# Altium schematic sheet BatteryManagementSystem.SchDoc
size A4; SheetNumber: 8; SheetTotal: 13
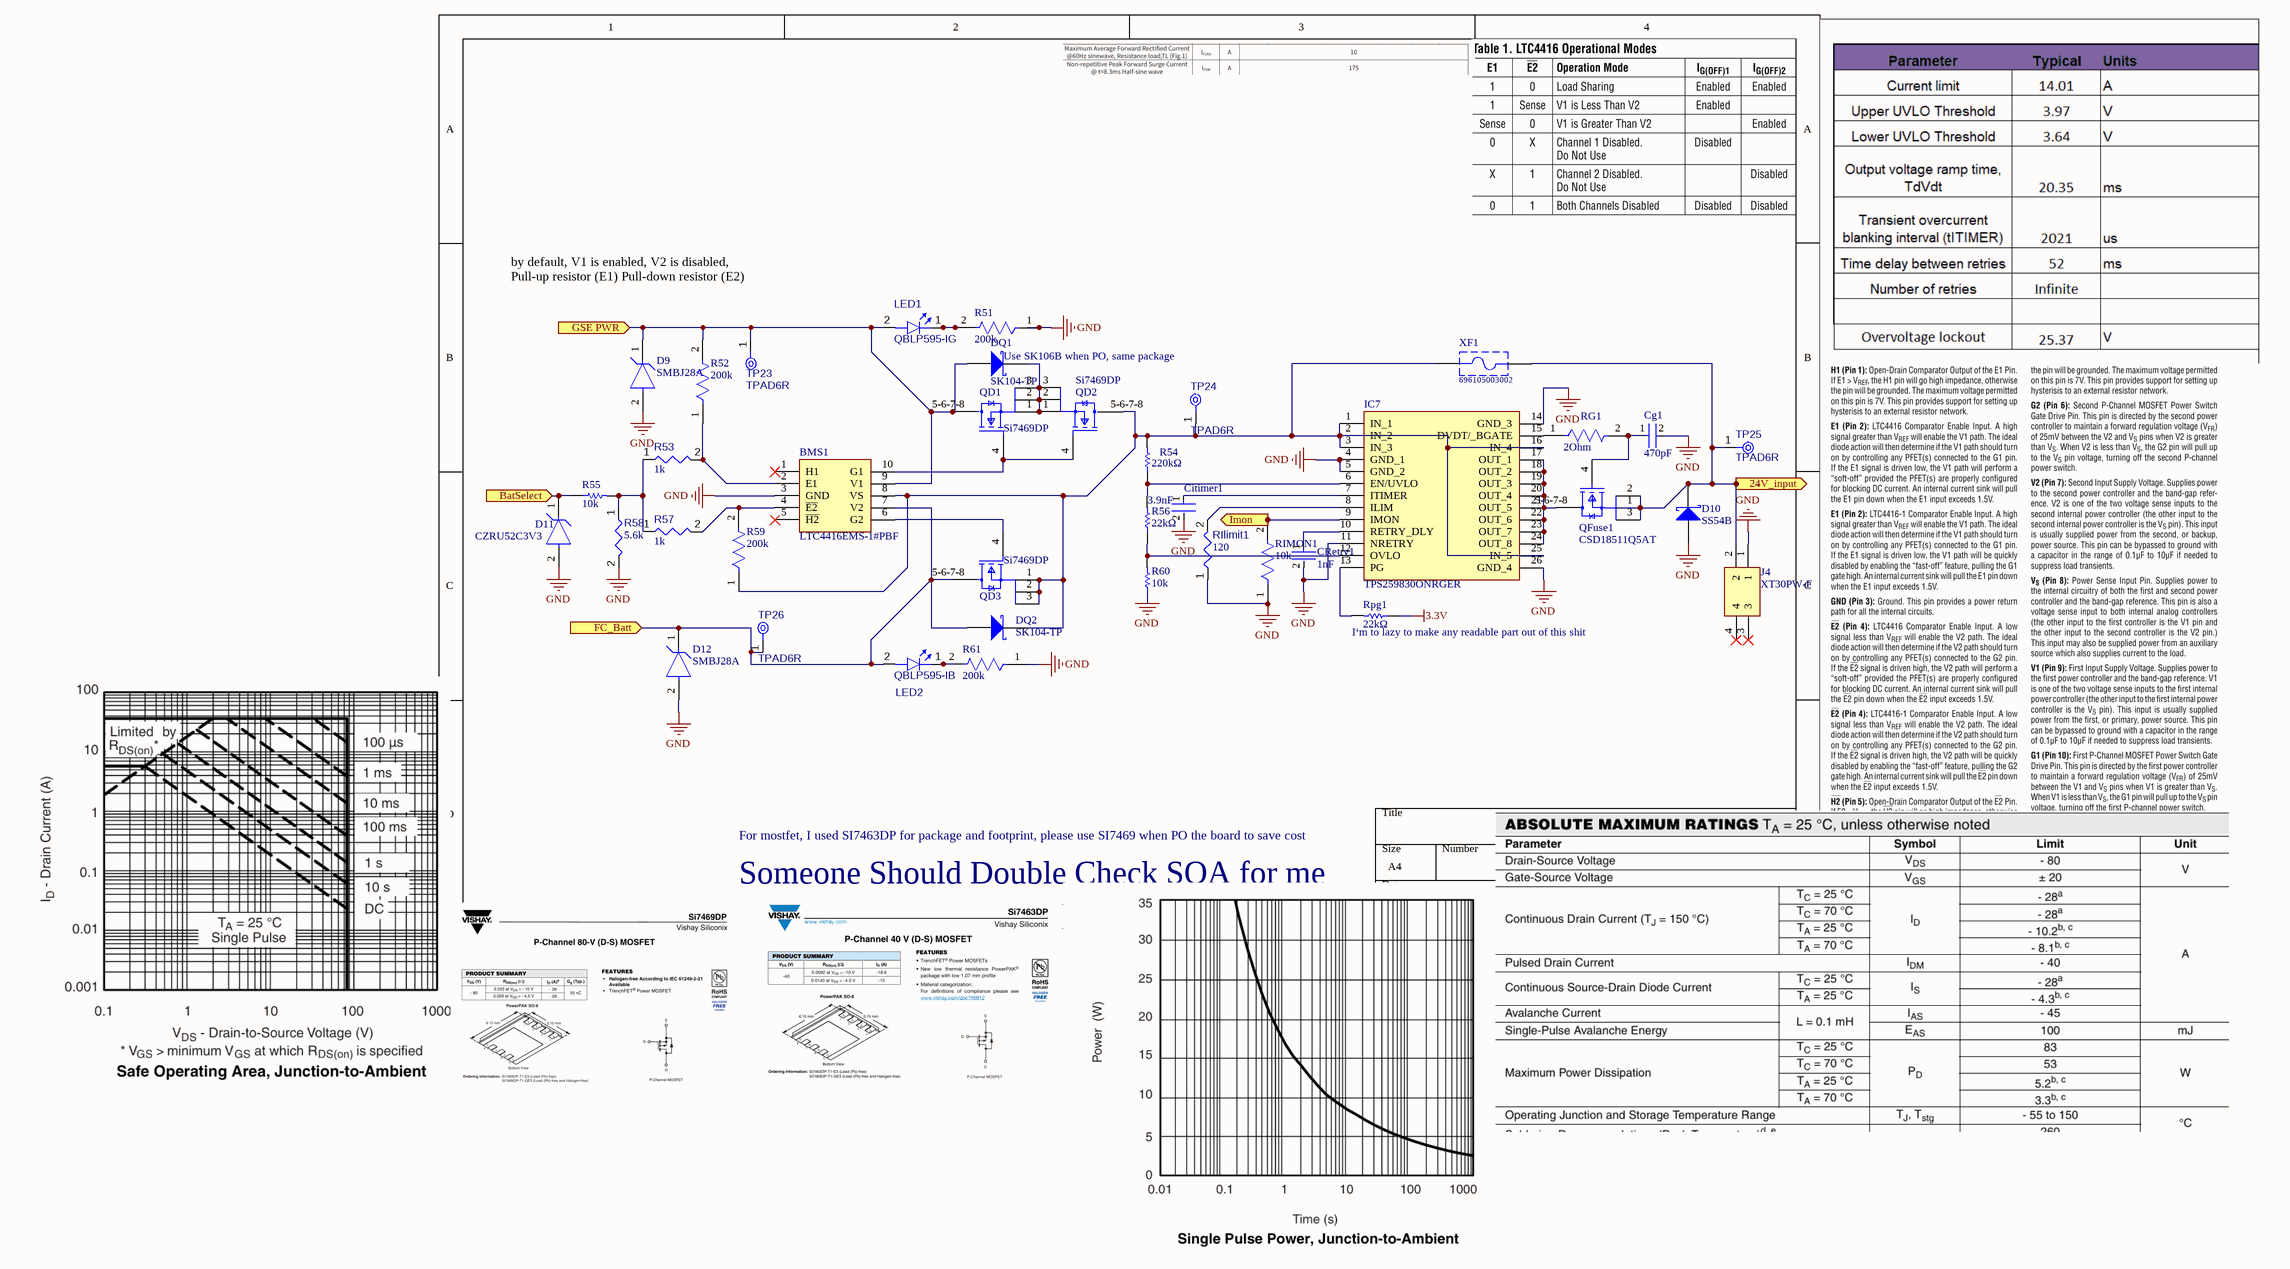
[diagram p0: BatteryManagementSystem.SchDoc]

## Parts
BMS1  LTC4416EMS-1#PBF  [SOP50P490X110-10N]
Cg1  470pF  [FP-CC0603-DA-MFG]
Citimer1  3.9nF  [FP-CC0603-DA-MFG]
CRetry1  1nF  [FP-0603-L_1_6_0_15-W_0_81-IPC_A]
D9  SMBJ28A  [FP-SMBJ-MFG]
D10  SS54B  [JCET-SMB-2_M]
D11  CZRU52C3V3  [FP-0603-SOD-523F-MFG]
D12  SMBJ28A  [FP-SMBJ-MFG]
DQ1  SK104-TP  [MCC-DO-214AB-2_V]
DQ2  SK104-TP  [MCC-DO-214AB-2_V]
IC7  TPS259830ONRGER  [TPS259830ONRGER]
J4  XT30PW-F  [XT30PWF]
LED1  QBLP595-IG  [QTB-QBLP595_V]
LED2  QBLP595-IB  [QTB-QBLP595_V]
QD1  Si7469DP  [FP-S17-0173-SINGLE-MFG]
QD2  Si7469DP  [FP-S17-0173-SINGLE-MFG]
QD3  Si7469DP  [FP-S17-0173-SINGLE-MFG]
QFuse1  CSD18511Q5AT  [FP-DQJ0008A-MFG]
R51  200k  [FP-RC0603-0_55-IPC_B]
R52  200k  [FP-RC0603-0_55-IPC_B]
R53  value 1k  [RESC1608X55X25ML10T15]  (hidden comment: Resistor 1k +/-1% 0603 100 mW)
R54  220kΩ  [RESC1608X55X30ML20T20]
R55  10k  [RESC1609X55X30LL15T15]
R56  22kΩ  [RESC1609X50X30ML10T20]
R57  value 1k  [RESC1608X55X25ML10T15]  (hidden comment: Resistor 1k +/-1% 0603 100 mW)
R58  value 5.6k  [RESC1608X55X25ML10T15]  (hidden comment: Resistor 10k +/-1% 0603 100 mW)
R59  200k  [FP-RC0603-0_55-IPC_B]
R60  10k  [RESC1609X55X30LL15T15]
R61  200k  [FP-RC0603-0_55-IPC_B]
RG1  2Ohm  [FP-CRCW2512-e3-IPC_C]
RIlimit1  value 120  [RESC0603(1608)_L]  (hidden comment: Resistor 120R +/-5 % 0603 0.1 W)
RIMON1  10k  [FP-CRCW0805-e3-IPC_A]
Rpg1  22kΩ  [RESC1609X50X30ML10T20]
TP23  TPAD6R  [TP06R]  (no BOM)
TP24  TPAD6R  [TP06R]  (no BOM)
TP25  TPAD6R  [TP06R]  (no BOM)
TP26  TPAD6R  [TP06R]  (no BOM)
XF1  696105003002  [696105003002]

## Ports
24V_input (out), BatSelect (in), FC_Batt (in), GSE PWR (in), Imon (out)

## Nets
3.3V: Rpg1.1
GND: BMS1.3(GND) Cg1.2 Citimer1.2 CRetry1.2 D9.2(A) D10.1(A) D11.2(A) D12.2(A) IC7.4(GND_1) IC7.5(GND_2) IC7.11(NRETRY) IC7.14(GND_3) IC7.26(GND_4) J4.1 R51.1 R58.2 R60.1 R61.1 RIlimit1.1 RIMON1.1
24V_input: D10.2(K) J4.2 QFuse1.1(S) QFuse1.2(S) QFuse1.3(S) TP25.1(TP) XF1.2 ; port 24V_input
BatSelect: D11.1(C) R55.1 ; port BatSelect
FC_Batt: BMS1.7(V2) D12.1(C) DQ2.1(A) LED2.2(A) QD3.5-6-7-8(D) TP26.1(TP) ; port FC_Batt
GSE PWR: BMS1.9(V1) D9.1(C) DQ1.1(A) LED1.2(A) QD1.5-6-7-8(D) R52.2 TP23.1(TP) ; port GSE PWR
Imon: IC7.9(IMON) RIMON1.2 ; port Imon
NetBMS1_2: BMS1.2(E1) R52.1 R53.2
NetBMS1_4: BMS1.4(~{E2}) R57.2 R59.2
NetBMS1_6: BMS1.6(G2) QD3.4(G)
NetBMS1_8: BMS1.8(VS) DQ2.2(K) IC7.1(IN_1) IC7.2(IN_2) IC7.3(IN_3) IC7.16(IN_4) IC7.25(IN_5) QD2.5-6-7-8(D) QD3.1(S) QD3.2(S) QD3.3(S) R54.2 R59.1 TP24.1(TP) XF1.1
NetBMS1_10: BMS1.10(G1) QD1.4(G) QD2.4(G)
NetCg1_1: Cg1.1 QFuse1.4(G) RG1.2
NetCitimer1_1: Citimer1.1 IC7.7(ITIMER)
NetCRetry1_1: CRetry1.1 IC7.10(RETRY_DLY)
NetDQ1_2: DQ1.2(K) QD1.1(S) QD1.2(S) QD1.3(S) QD2.1(S) QD2.2(S) QD2.3(S)
NetIC7_6: IC7.6(EN/UVLO) R54.1 R56.2
NetIC7_8: IC7.8(ILIM) RIlimit1.2
NetIC7_12: IC7.12(OVLO) R56.1 R60.2
NetIC7_13: IC7.13(PG) Rpg1.2
NetIC7_15: IC7.15(DVDT/_BGATE) RG1.1
NetIC7_17: IC7.17(OUT_1) IC7.18(OUT_2) IC7.19(OUT_3) IC7.20(OUT_4) IC7.21(OUT_5) IC7.22(OUT_6) IC7.23(OUT_7) IC7.24(OUT_8) QFuse1.5-6-7-8(D)
NetLED1_1: LED1.1(K) R51.2
NetLED2_1: LED2.1(K) R61.2
NetR53_1: R53.1 R55.2 R57.1 R58.1

Not connected (* = marked no-connect by the designer): BMS1 1(H1)* 5(~{H2})*; J4 3* 4*

## Notes on the sheet
- by default, V1 is enabled, V2 is disabled, Pull-up resistor (E1) Pull-down resistor (E2)
- (near DQ1) Use SK106B when PO, same package
- (near Rpg1) I‘m to lazy to make any readable part out of this shit
- Someone Should Double Check SOA for me
- For mostfet, I used SI7463DP for package and footprint, please use SI7469 when PO the board to save cost

## Library data of the parts
BMS1 = LTC4416EMS-1#PBF: Integrated Circuit; Manufacturer_Name: Analog Devices; Datasheet Link: https://www.analog.com/media/en/technical-documentation/data-sheets/4416fa.pdf; Height: 1.1mm; Manufacturer_Part_Number: LTC4416EMS-1#PBF; Mouser Part Number: 584-LTC4416EMS-1#PBF; Mouser Price/Stock: https://www.mouser.co.uk/ProductDetail/Analog-Devices/LTC4416EMS-1PBF?qs=hVkxg5c3xu9mDay6QbsUoQ%3D%3D; Arrow Part Number: LTC4416EMS-1#PBF; Arrow Price/Stock: https://www.arrow.com/en/products/ltc4416ems-1pbf/analog-devices?region=nac
Cg1 = CMP-03422-000635-2: CAP CER 470pF 50V X7R 0603; Tolerance: 10%; Dielectric Material: Ceramic; Capacitance: 3.9nF; Insulation Resistance: 100GR; Height: 0.8mm; Voltage Rating: 50V; Termination: SMD/SMT; REACH SVHC: No SVHC; Resistor Type: Ceramic; Radiation Hardening: No; Case Code (Imperial): 0603; Voltage: 50V; Series: CC; Mount: Surface Mount; Length: 1.6mm; RoHS Compliant: Yes; Lead Free: Lead Free; Width: 0.8mm; Package Quantity: 4000; Packaging: Tape and Reel; Dielectric: X7R; Voltage Rating (DC): 50V; Min Operating Temperature: -55°C; Depth: 0.8mm; Halogen Free: Halogen Free; Case/Package: 0603; Thickness: 0.035inch; Number of Pins: 2; Max Operating Temperature: 125°C; Case Code (Metric): 1608; Construction: Flat
Citimer1 = CMP-03422-000635-2: CAP CER 3900PF 50V X7R 0603; Tolerance: 10%; Dielectric Material: Ceramic; Insulation Resistance: 100GR; Height: 0.8mm; Voltage Rating: 50V; Termination: SMD/SMT; REACH SVHC: No SVHC; Resistor Type: Ceramic; Radiation Hardening: No; Case Code (Imperial): 0603; Voltage: 50V; Series: CC; Mount: Surface Mount; Length: 1.6mm; RoHS Compliant: Yes; Lead Free: Lead Free; Capacitance: 3.9nF; Width: 0.8mm; Package Quantity: 4000; Packaging: Tape and Reel; Dielectric: X7R; Voltage Rating (DC): 50V; Min Operating Temperature: -55°C; Depth: 0.8mm; Halogen Free: Halogen Free; Case/Package: 0603; Thickness: 0.035inch; Number of Pins: 2; Max Operating Temperature: 125°C; Case Code (Metric): 1608; Construction: Flat
CRetry1 = CMP-2006-04378-2: General Purpose Ceramic Capacitor, 0603, 1nF, 10%, X7R, 15%, 50V; Case Code (Metric): 1608; Min Operating Temperature: -55°C; Weight: 7.1E-05oz; Series: -; Capacitance: 1nF; RoHS Compliant: Yes; Radiation Hardening: No; Height: 0.9mm; Mount: Surface Mount; REACH SVHC: No SVHC; Lead Free: Lead Free; Depth: 0.81mm; Voltage: 50V; Number of Pins: 2; Voltage Rating: 50V; Max Operating Temperature: 125°C; Termination: SMD/SMT; Construction: Flat; Case Code (Imperial): 0603; Dielectric: X7R; Width: 0.032inch; Tolerance: 10%; Case/Package: 0603; Contact Plating: Tin; Packaging: Tape and Reel; Voltage Rating (DC): 50V; Dielectric Material: Ceramic; Package Quantity: 4000; Thickness: 0.035inch; Length: 1.6mm
D9 D12 = CMP-08607-000081-1: TVS DIODE 28V 45.4V DO214AA; Manufacturer: Littelfuse Inc; Breakdown Voltage: 31.1V; Direction: Unidirectional; Number Of Channels: 1; Peak Pulse Power: 600W; Max Junction Temp: +150°C; Peak Pulse Current: 13.3A; Temperature: -65°C to +150°C; Category: Diode; RoHS: TRUE; Height: 2.61mm; Reverse Standoff Voltage: 28V; Device Class L1: Circuit Protection; Temperature Range Low: -65°C; ComponentLink2Description: Datasheet; Digikey Description: TVS DIODE 28V 45.4V DO214AA; Automotive: No; Package: SMBJ; Mouser Description: Littelfuse SMBJ28A, Uni-Directional TVS Diode, 600W, 2-Pin DO-214AA; ComponentLink2URL: https://www.littelfuse.com/~/media/electronics/datasheets/tvs_diodes/littelfuse_tvs_diode_smbj_datasheet.pdf.pdf; Manufacturer Part Number: SMBJ28A; Octopart: https://octopart.com/smbj28a-littelfuse-350790; Clamping Voltage: 45.4V; Temperature Range High: +150°C; Device Class L3: unset; Device Class L2: TVS Diodes; Lead Free: Yes
D10 = CMP-004-00006-2: Schottky Barrier Rectifier, 40 V, 5 A, -55 to 150 degC, 2-Pin SMD; Manufacturer: JCET; Datasheet URL: http://wiki.seeedstudio.com/images/3/3f/0310130P1.pdf; Datasheet Version: May-13; Package Reference: SMB-2; RoHS Compliant: Unknown; Manufacturer URL: http://www.cj-elec.com/; Mounting Technology: SM; Package Description: 2-Pin Surface Mount Device, Body 4.315 x 3.62 mm; Case/Package: SMB-2
D11 = CMP-20229-000003-1: DIODE ZENER 3.3V 150MW 0603; Zener Current: 5mA; Tolerance: 5%; Output Current: 500mA; Impedance: 95R; Element Configuration: Single; Max Reverse Leakage Current: 25uA; Max Operating Temperature: 125°C; Max Power Dissipation: 150mW; Power Rating: 150mW; Lead Free: Lead Free; Mount: Surface Mount; Packaging: Tape and Reel; Voltage Tolerance: 5%; Power Dissipation: 150mW; Zener Voltage: 3.3V; Min Operating Temperature: -55°C; Case/Package: SMD/SMT; Voltage Rating (DC): 3.3V; Package Quantity: 1
DQ1 DQ2 = CMP-2000-05214-1: Schottky Rectifier, 40 V, 10 A, -55 to 125 degC, 2-Pin SMD, RoHS, Tape and Reel; Manufacturer: Micro Commercial Components; Max Surge Current: 250A; Maximum Reverse Leakage Current: 1mA; Peak Reverse Voltage: 40V; Forward Continuous Current: 10A; Mounting Style: SMD/SMT; Product: SchottkyRectifiers; Manufacturer URL: http://www.mccsemi.com/; Datasheet URL: https://datasheet.ciiva.com/4718/sk102-sk1010hsmc-27683-4718371.pdf; Datasheet Version: Rev. B, 05/2012; RoHS: Details; Packaging: Reel; Package / Case: DO-214AB; Operating Temperature Range: -55Cto+125C
IC7 = TPS259830ONRGER: Integrated Circuit; Manufacturer_Name: Texas Instruments; Datasheet Link: https://www.ti.com/lit/gpn/tps25983; Height: 1mm; Manufacturer_Part_Number: TPS259830ONRGER; Mouser Part Number: 595-TPS259830ONRGER; Mouser Price/Stock: https://www.mouser.co.uk/ProductDetail/Texas-Instruments/TPS259830ONRGER?qs=ST9lo4GX8V2yYPVZTyti6w%3D%3D; Arrow Part Number: TPS259830ONRGER; Arrow Price/Stock: https://www.arrow.com/en/products/tps259830onrger/texas-instruments?utm_currency=USD&region=nac
J4 = XT30PW-F: Connector; Manufacturer_Name: Amass; Datasheet Link: https://www.tme.eu/Document/ce4077e36b79046da520ca73227e15de/XT30PW%20SPEC.pdf; Height: 5mm; Manufacturer_Part_Number: XT30PW-F
LED1 = CMP-007-00041-3: Chip LED 0402, Green, 0.02 A, 3.1 to 3.7 V, -40 to 80 degC, 2-Pin SMD, RoHS, Tape and Reel; Case/Package: 0402; Colour: Green; Mounting Technology: SMT; Pins: 2; RoHS Compliant: Yes
LED2 = CMP-007-00042-3: Chip LED 0402, Blue, 0.02 A, 3.1 to 3.7 V, -40 to 80 degC, 2-Pin SMD, RoHS, Tape and Reel; RoHS Compliant: Yes; Colour: Blue; Pins: 2; Case/Package: 0402; Mounting Technology: SMT
QD1 QD3 = CMP-02550-000199-1: Use Si7469DP For PCBA. MOSFET P-CH 40V 11A PPAK SO-8; Manufacturer: Vishay; Manufacturer Part Number: SI7463DP-T1-E3; Depletion Mode: False; Number Of Channels: 1; Pulse Drain Current: -60A; Typ Forward Diode Voltage: -0.8V; Drain To Source Voltage: -40V; Rthja Max: 52°C/W; Turn On Delay Time: 20ns; Continuous Drain Current: -11A; Max Junction Temp: +150°C; Gate Charge At Vgs: 121nC @ -10V; Max Forward Diode Voltage: -1.2V; Reverse Recovery Time: 45ns; Gate To Source Voltage: 20V; Threshold Vgs Min: -1V; Standoff Height: 0mm; Turn Off Delay Time: 200ns; Threshold Vgs Max: -3V; Transconductance: 50S; Drain To Source Resistance: 0.0075Ω; Power Dissipation: 1.9W; Temperature Range Low: -55°C; Lead Free: Yes; Device Class L3: MOSFETs; Automotive: No; Digikey Description: MOSFET P-CH 40V 11A PPAK SO-8; ComponentLink2Description: Datasheet; Octopart: https://octopart.com/si7463dp-t1-e3-vishay-42065245; Number Of P Channels: 1; Device Class L1: Discrete Semiconductors; ComponentLink2URL: http://www.vishay.com/docs/72440/si7463dp.pdf; Device Class L2: Transistors; RoHS: TRUE; Category: Trans; Mouser Description: MOSFET 40V 18.6A 5.4W 9.2mohm @ 10V; Package: S17-0173-SINGLE; Height: 1.17mm; Temperature Range High: +150°C; Temperature: -55°C to +150°C
QD2 = CMP-02550-000199-1: MOSFET P-CH 40V 11A PPAK SO-8; Manufacturer: Vishay; Manufacturer Part Number: SI7463DP-T1-E3; Depletion Mode: False; Number Of Channels: 1; Pulse Drain Current: -60A; Typ Forward Diode Voltage: -0.8V; Drain To Source Voltage: -40V; Rthja Max: 52°C/W; Turn On Delay Time: 20ns; Continuous Drain Current: -11A; Max Junction Temp: +150°C; Gate Charge At Vgs: 121nC @ -10V; Max Forward Diode Voltage: -1.2V; Reverse Recovery Time: 45ns; Gate To Source Voltage: 20V; Threshold Vgs Min: -1V; Standoff Height: 0mm; Turn Off Delay Time: 200ns; Threshold Vgs Max: -3V; Transconductance: 50S; Drain To Source Resistance: 0.0075Ω; Power Dissipation: 1.9W; Temperature Range Low: -55°C; Lead Free: Yes; Device Class L3: MOSFETs; Automotive: No; Digikey Description: MOSFET P-CH 40V 11A PPAK SO-8; ComponentLink2Description: Datasheet; Octopart: https://octopart.com/si7463dp-t1-e3-vishay-42065245; Number Of P Channels: 1; Device Class L1: Discrete Semiconductors; ComponentLink2URL: http://www.vishay.com/docs/72440/si7463dp.pdf; Device Class L2: Transistors; RoHS: TRUE; Category: Trans; Mouser Description: MOSFET 40V 18.6A 5.4W 9.2mohm @ 10V; Package: S17-0173-SINGLE; Height: 1.17mm; Temperature Range High: +150°C; Temperature: -55°C to +150°C
QFuse1 = CMP-04962-000088-1: MOSFET N-CH 40V 159A 8VSON; Rds On Max: 3.5mR; Element Configuration: Single; Max Power Dissipation: 104W; Input Capacitance: 5.85nF; Mount: Surface Mount; Min Operating Temperature: -55°C; Packaging: Tape and Reel; Number of Pins: 8; RoHS Compliant: Yes; Continuous Drain Current (ID): 159A; Max Operating Temperature: 150°C; Drain to Source Voltage (Vdss): 40V
R51 R52 R59 R61 = CMP-03412-037786-1: RES SMD 200K OHM 1% 1/10W 0603; Temperature Coefficient: 100ppm/°C; Voltage Rating: 50V; Resistance: 200kR; Max Power Dissipation: 100mW; Packaging: Tape and Reel; REACH SVHC: No SVHC; Resistance Tolerance: 1%; Number of Pins: 2; Width: 0.031inch; Termination: SMD/SMT; Features: Moisture Resistant; Tolerance: 1%; Series: RC; Case Code (Imperial): 0603; Depth: 0.8mm; Number of Terminations: 2; Max Operating Temperature: 155°C; Resistor Type: Thick Film; Height: 0.022inch; Lead Free: Lead Free; Construction: Rectangular; Case/Package: 0603; Power Rating: 100mW; Case Code (Metric): 1608; Length: 1.6mm; Size Code: 0603; RoHS Compliant: Yes; Military Standard: Not; Min Operating Temperature: -55°C; Package Quantity: 1; Voltage Rating (DC): 50V
R53 R57 = CMP-009-00014-5: Chip Resistor, 1 KOhm, +/-1%, 0.1 W, -55 to 155 degC, 0603 (1608 Metric); Voltage Rating: 50V; Power: 100mW; Tolerance: 1%; Mounting Technology: SM; Pins: 2; Case/Package: 0603; Min Operating Temperature: -55°C; RoHS Compliant: True; Max Operating Temperature: 155°C
R54 = CMP-2000-00054-1: Fixed Resistor, Thin Film, 0.1W, 210000ohm, 75V, 0.1% +/-Tol, 25ppm/Cel, Surface Mount, 0603; Part Number: ERA3AEB392V; Manufacturer: Panasonic
R55 R60 = CMP-1012-00623-3: Chip Resistor, 10 KOhm, +/- 1%, 0.1 W, -55 to 155 degC, 0603 (1608 Metric), RoHS, Tape and Reel; Manufacturer: Panasonic; Voltage Rating: 75V; Case\/Package: 0603; Power Rating: 100mW; Resistance: 10KOhm; Temperature Coefficient: 100ppm\/degreesC; Number of Pins: 2; Package Reference: 603; Depth: 0.8mm; Mount: SurfaceMount; Package Description: 2-Pin Surface Mount Device, Body 1.6 x 0.85 mm; Datasheet Version: 02/2017; Length: 1.6mm; Lead Free: LeadFree; Height: 0.45mm; Number of Terminations: 2; Max Power Dissipation: 100mW; Min Operating Temperature: -55degC; Datasheet URL: https://industrial.panasonic.com/cdbs/www-data/pdf/RDA0000/AOA0000C304.pdf; Termination: SMD/SMT; Case Code (Metric): 1608; Case Code (Imperial): 0603; Tolerance: 1%; Max Operating Temperature: 155degC; RoHSCompliant: true; Voltage Rating (DC): 75V; Radiation Hardening: No; Packaging: TapeandReel; Composition: ThickFilm; Mounting Technology: SurfaceMount; Manufacturer URL: http://www.panasonic.com/; Width: 0.031inch; REACH SVHC: NoSVHC; Contact Plating: Tin; Military Standard: Not; Package Quantity: 1
R56 Rpg1 = CMP-2000-02954-1: Fixed Resistor, Metal Glaze/thick Film, 0.1W, 18000ohm, 75V, 1% +/-Tol, 100ppm/Cel, Surface Mount, 0603; Part Number: CRCW0603182KFKEA; Manufacturer: Vishay Dale
R58 = CMP-009-00017-5: Chip Resistor, 10 KOhm, +/- 1%, 01 W, -55 to 155 degC, 0603 (1608 Metric); Voltage Rating: 50V; Power: 100mW; RoHS Compliant: True; Min Operating Temperature: -55°C; Pins: 2; Case/Package: 0603; Mounting Technology: SM; Max Operating Temperature: 155°C; Tolerance: 1%
RG1 = CMP-02407-006382-1: RES Thick Film, 2Ω, 5%, 1W, 200ppm/°C, 2512; Voltage Rating (DC): 500V; Resistance: 2R; Max Power Dissipation: 1W; Case Code (Imperial): 2512; Depth: 3.15mm; Tolerance: 5%; Temperature Coefficient: 200ppm/°C; Lead Free: Lead Free; Length: 6.3mm; Number of Pins: 2; Military Standard: Not; Min Operating Temperature: -55°C; Height: 0.6mm; Packaging: Tape and Reel; Contact Plating: Tin; Power Rating: 1W; Number of Terminations: 2; Package Quantity: 1; Weight: 0.001429oz; Case Code (Metric): 6432; Termination: SMD/SMT; Features: Automotive AEC-Q200; Radiation Hardening: No; Case/Package: 2512; Composition: Thick Film; Voltage Rating: 500V; Width: 0.124inch; Max Operating Temperature: 155°C
RIlimit1 = CMP-009-00176-3: Chip Resistor, 120 Ohms, +/-5 %, 0.1 W, -55 to 155 degC, 0603; Power: 100mW; Tolerance: 5%; Max Operating Temperature: 155°C; Pins: 2; Case/Package: 0603; Min Operating Temperature: -55°C
RIMON1 = CMP-2001-04908-2: RES Thick Film, 10kΩ, 1%, 0.125W, 100ppm/°C, 0805; Resistance: 10kR; Voltage Rating (DC): 150V; Power Rating: 125mW; Weight: 0.000194oz; Package Quantity: 5000; Military Standard: Not; Max Operating Temperature: 155°C; Temperature Coefficient: 100ppm/°C; Contact Plating: Tin; Width: 1.25mm; Height: 0.45mm; Radiation Hardening: No; Tolerance: 1%; Min Operating Temperature: -55°C; Voltage Rating: 150V; Length: 2mm; Depth: 1.25mm; Termination: SMD/SMT; Packaging: Tape and Reel; Case/Package: 0805; Case Code (Metric): 2012; Lead Free: Lead Free; Case Code (Imperial): 0805; Composition: Thick Film
TP23-TP26 = CMP-00028-00002-2: 0.6mm round; Pins: 1
XF1 = CMP-1502-00234-1: WR-FSH Fuse Holder Blocks Fuse Holder Blocks Clip Cover for PCB; Manufacturer: Wurth Elektronik; Fuse Size: 5x20mm; Mounting Technology: THT; Publisher: WurthElektronik; Manufacturer URL: http://www.we-online.de; Package Reference: 696105003002; Part Number: 696105003002; Packaging: Box; Datasheet URL: https://katalog.we-online.de/em/datasheet/696105003002.pdf; Operating Temperature: -30to120degC